# EAGLE design Motor_Surucu_V4 (EAGLE 9.6.2)
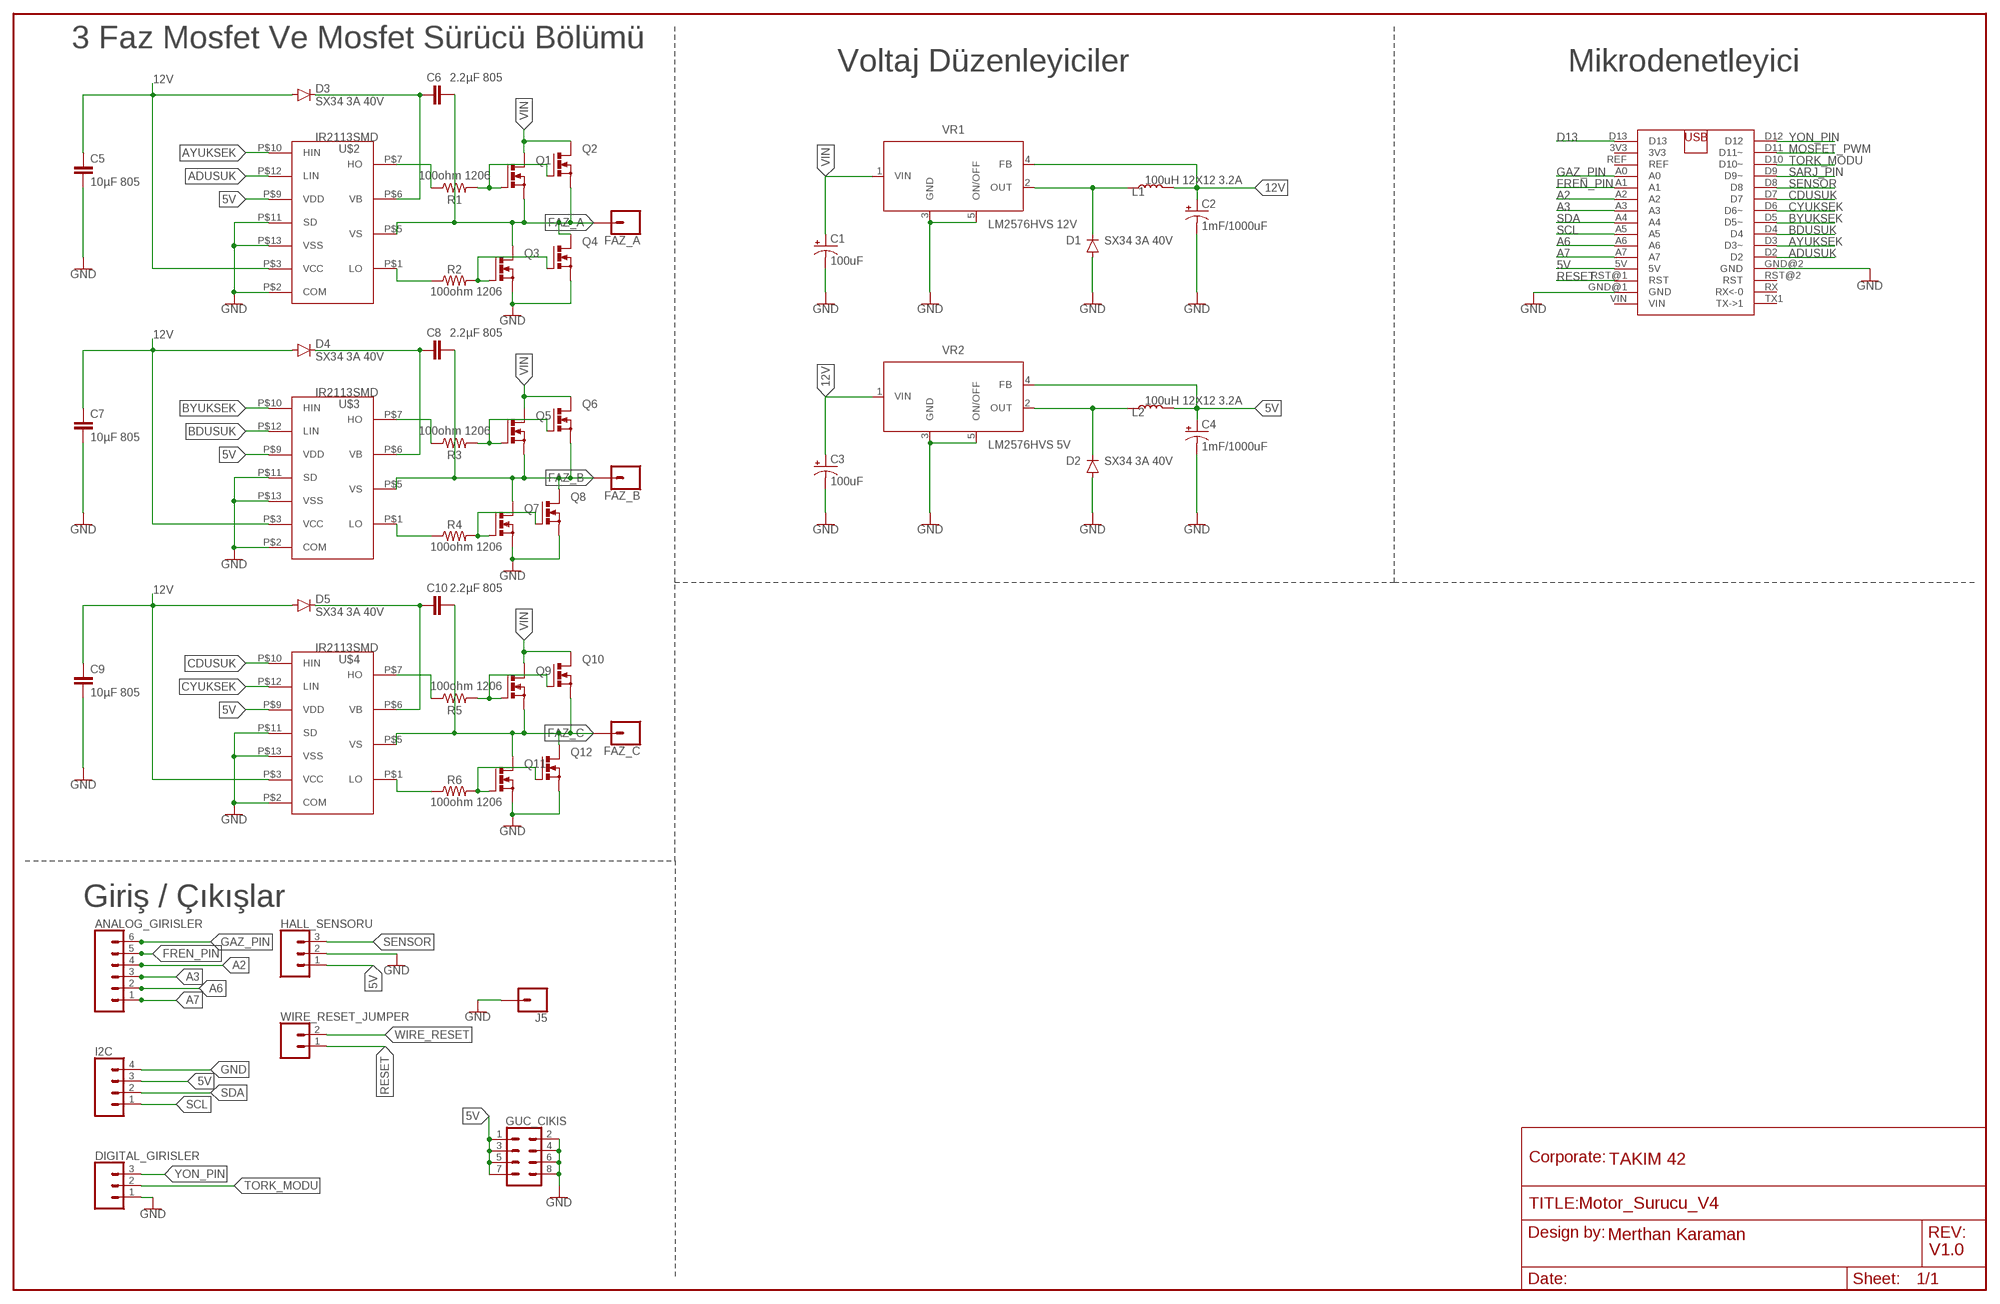
[diagram p0: schematic, sheet 1]
FRAME1 (FRAME-LEDGER): CORPO: TAKIM 42; DESIGNER: Merthan Karaman; REV: V1.0

## Parts
ANALOG_GIRISLER  CONN_06SILK_FEMALE_PTH  [1X06]
C1  100uF  100UF-POLAR-RADIAL-2.5MM-25V-20%  [CPOL-RADIAL-2.5MM-6.5MM]
C2  1mF/1000uF  560UF-PANASONIC_G-25V-20%  [PANASONIC_G]
C3  100uF  100UF-POLAR-RADIAL-2.5MM-25V-20%  [CPOL-RADIAL-2.5MM-6.5MM]
C4  1mF/1000uF  560UF-PANASONIC_G-25V-20%  [PANASONIC_G]
C5  10µF 805  0.33UF/330NF-0805-50V-10%  [0805]
C6  2.2µF 805  0.33UF/330NF-0805-50V-10%  [0805]
C7  10µF 805  0.33UF/330NF-0805-50V-10%  [0805]
C8  2.2µF 805  0.33UF/330NF-0805-50V-10%  [0805]
C9  10µF 805  0.33UF/330NF-0805-50V-10%  [0805]
C10  2.2µF 805  0.33UF/330NF-0805-50V-10%  [0805]
D1  SX34 3A 40V  DIODE-DO214AC  [DO214AC]
D2  SX34 3A 40V  DIODE-DO214AC  [DO214AC]
D3  SX34 3A 40V  DIODE-DO214AC  [DO214AC]
D4  SX34 3A 40V  DIODE-DO214AC  [DO214AC]
D5  SX34 3A 40V  DIODE-DO214AC  [DO214AC]
DIGITAL_GIRISLER  CONN_03  [1X03]
FAZ_A  CONN_01SNAP-MALE  [SNAP-MALE]
FAZ_B  CONN_01SNAP-MALE  [SNAP-MALE]
FAZ_C  CONN_01SNAP-MALE  [SNAP-MALE]
GUC_CIKIS  CONN_04X2  [2X4]
HALL_SENSORU  CONN_03  [1X03]
I2C  CONN_04  [1X04]
J5  CONN_01SNAP-MALE  [SNAP-MALE]
L1  100uH 12X12 3.2A  INDUCTOR-SDR13-27UH  [INDUCTOR_SDR1307]
L2  100uH 12X12 3.2A  INDUCTOR-SDR13-27UH  [INDUCTOR_SDR1307]
Q1  PMOSFET_NTO220BV  [TO220BV]
Q2  PMOSFET_NTO220BV  [TO220BV]
Q3  PMOSFET_NTO220BV  [TO220BV]
Q4  PMOSFET_NTO220BV  [TO220BV]
Q5  PMOSFET_NTO220BV  [TO220BV]
Q6  PMOSFET_NTO220BV  [TO220BV]
Q7  PMOSFET_NTO220BV  [TO220BV]
Q8  PMOSFET_NTO220BV  [TO220BV]
Q9  PMOSFET_NTO220BV  [TO220BV]
Q10  PMOSFET_NTO220BV  [TO220BV]
Q11  PMOSFET_NTO220BV  [TO220BV]
Q12  PMOSFET_NTO220BV  [TO220BV]
R1  100ohm 1206  RESISTOR1206  [1206]
R2  100ohm 1206  RESISTOR1206  [1206]
R3  100ohm 1206  RESISTOR1206  [1206]
R4  100ohm 1206  RESISTOR1206  [1206]
R5  100ohm 1206  RESISTOR1206  [1206]
R6  100ohm 1206  RESISTOR1206  [1206]
U$1  ARDUINO_NANO  [ARDUINO_NANO]
U$2  IR2113SMD  [SOIC-14]
U$3  IR2113SMD  [SOIC-14]
U$4  IR2113SMD  [SOIC-14]
VR1  LM2576HVS 12V  LM2576HVS-5.0/NOPBTO-263  [TO170P1435X465-6N]
VR2  LM2576HVS 5V  LM2576HVS-5.0/NOPBTO-263  [TO170P1435X465-6N]
WIRE_RESET_JUMPER  CONN_02  [1X02]

## Nets
5V: C4.+ GUC_CIKIS.1 GUC_CIKIS.3 GUC_CIKIS.5 GUC_CIKIS.7 HALL_SENSORU.1 I2C.3 L2.P$2 U$1.5V U$2.P$9(VDD) U$3.P$9(VDD) U$4.P$9(VDD) VR2.4(FB)
12V: C2.+ C3.1(+) C5.1 C7.1 C9.1 D3.A D4.A D5.A L1.P$2 U$2.P$3(VCC) U$3.P$3(VCC) U$4.P$3(VCC) VR1.4(FB) VR2.1(VIN)
A2: ANALOG_GIRISLER.4 U$1.A2
A3: ANALOG_GIRISLER.3 U$1.A3
A6: ANALOG_GIRISLER.2 U$1.A6
A7: ANALOG_GIRISLER.1 U$1.A7
ADUSUK: U$1.D2 U$2.P$12(LIN)
AYUKSEK: U$1.D3(D3~) U$2.P$10(HIN)
BDUSUK: U$1.D4 U$3.P$12(LIN)
BYUKSEK: U$1.D5(D5~) U$3.P$10(HIN)
CDUSUK: U$1.D7 U$4.P$10(HIN)
CYUKSEK: U$1.D6(D6~) U$4.P$12(LIN)
D13: U$1.D13
FAZ_A: C6.2 FAZ_A.2 Q1.S Q2.S Q3.D Q4.D U$2.P$5(VS)
FAZ_B: C8.2 FAZ_B.2 Q5.S Q6.S Q7.D Q8.D U$3.P$5(VS)
FAZ_C: C10.2 FAZ_C.2 Q9.S Q10.S Q11.D Q12.D U$4.P$5(VS)
FREN_PIN: ANALOG_GIRISLER.5 U$1.A1
GAZ_PIN: ANALOG_GIRISLER.6 U$1.A0
GND: C1.2(-) C2.- C3.2(-) C4.- C5.2 C7.2 C9.2 D1.A D2.A DIGITAL_GIRISLER.1 GUC_CIKIS.2 GUC_CIKIS.4 GUC_CIKIS.6 GUC_CIKIS.8 HALL_SENSORU.2 I2C.4 J5.2 Q3.S Q4.S Q7.S Q8.S Q11.S Q12.S U$1.GND@1(GND) U$1.GND@2(GND) U$2.P$2(COM) U$2.P$11(SD) U$2.P$13(VSS) U$3.P$2(COM) U$3.P$11(SD) U$3.P$13(VSS) U$4.P$2(COM) U$4.P$11(SD) U$4.P$13(VSS) VR1.3(GND) VR1.5(ON/OFF) VR2.3(GND) VR2.5(ON/OFF)
MOSFET_PWM: U$1.D11(D11~)
N$1: D2.C L2.P$1 VR2.2(OUT)
N$2: Q1.G Q2.G R1.2
N$3: Q5.G Q6.G R3.2
N$4: C6.1 D3.C U$2.P$6(VB)
N$5: R5.1 U$4.P$7(HO)
N$6: R1.1 U$2.P$7(HO)
N$7: Q3.G Q4.G R2.2
N$8: R2.1 U$2.P$1(LO)
N$9: C8.1 D4.C U$3.P$6(VB)
N$10: R3.1 U$3.P$7(HO)
N$11: Q9.G Q10.G R5.2
N$12: Q7.G Q8.G R4.2
N$13: R4.1 U$3.P$1(LO)
N$14: C10.1 D5.C U$4.P$6(VB)
N$17: Q11.G Q12.G R6.2
N$18: R6.1 U$4.P$1(LO)
N$19: D1.C L1.P$1 VR1.2(OUT)
RESET: U$1.RST@1(RST) WIRE_RESET_JUMPER.1
SARJ_PIN: U$1.D9(D9~)
SCL: I2C.1 U$1.A5
SDA: I2C.2 U$1.A4
SENSOR: HALL_SENSORU.3 U$1.D8
TORK_MODU: DIGITAL_GIRISLER.2 U$1.D10(D10~)
VIN: C1.1(+) Q1.D Q2.D Q5.D Q6.D Q9.D Q10.D VR1.1(VIN)
WIRE_RESET: WIRE_RESET_JUMPER.2
YON_PIN: DIGITAL_GIRISLER.3 U$1.D12
Unconnected: U$1.3V3 U$1.REF U$1.RST@2(RST) U$1.RX(RX<-0) U$1.TX1(TX->1) U$1.VIN

## Notes on the sheet
- 3 Faz Mosfet Ve Mosfet Sürücü Bölümü
- Voltaj Düzenleyiciler | Mikrodenetleyici
- Giriş / Çıkışlar

## Library data of the parts
ANALOG_GIRISLER = SparkFun-Connectors:CONN_06: Multi connection point. Often used as Generic Header-pin footprint for 0.1 inch spaced/style header connections On any of the 0.1 inch spaced packages, you can populate with these: Break Away Headers - Straight <https://www.sparkfun.com/products/116> (PRT-00116) Break Away Male Headers - Right Angle <https://www.sparkfun.com/products/553> (PRT-00553) Female Headers <https://www.sparkfun.com/products/115> (PRT-00115) Break Away Headers - Machine Pin <https://www.sparkfun.com/products/117> (PRT-00117) Break Away Female Headers - Swiss Machine Pin <https://www.sparkfun.com/products/743> (PRT-00743) Arduino Stackable Header - 6 Pin <https://www.sparkfun.com/products/9280> (PRT-09280) For SCREWTERMINALS and SPRING TERMINALS visit here: Screw Terimnals on SparkFun.com <https://www.sparkfun.com/search/results?term=Screw+Terminals> (5mm/3.5mm/2.54mm spacing) This device is also useful as a general connection point to wire up your design to another part of your project. Our various solder wires solder well into these plated through hole pads. Hook-Up Wire - Assortment (Stranded, 22 AWG) <https://www.sparkfun.com/products/11375> (PRT-11375) Hook-Up Wire - Assortment (Solid Core, 22 AWG) <https://www.sparkfun.com/products/11367> (PRT-11367) View the entire wire category on our website here <https://www.sparkfun.com/categories/141>; PROD_ID: CONN-08437
C1 C3 = SparkFun-Capacitors:100UF-POLAR: 100µF polarized capacitors A capacitor is a passive two-terminal electrical component used to store electrical energy temporarily in an electric field.; PROD_ID: CAP-08439
C2 C4 = SparkFun-Capacitors:560UF: 560µF polarized capacitors A capacitor is a passive two-terminal electrical component used to store electrical energy temporarily in an electric field.; PROD_ID: CAP-09983; VALUE: 560uF
C5-C10 = SparkFun-Capacitors:0.33UF/330NF: 0.33µF/330nF ceramic capacitors A capacitor is a passive two-terminal electrical component used to store electrical energy temporarily in an electric field.; PROD_ID: CAP-08469; VALUE: 0.33µF
D1-D5 = diode:DIODE-: DIODE
DIGITAL_GIRISLER HALL_SENSORU = SparkFun-Connectors:CONN_03: Multi connection point. Often used as Generic Header-pin footprint for 0.1 inch spaced/style header connections On any of the 0.1 inch spaced packages, you can populate with these: Break Away Headers - Straight <https://www.sparkfun.com/products/116> (PRT-00116) Break Away Male Headers - Right Angle <https://www.sparkfun.com/products/553> (PRT-00553) Female Headers <https://www.sparkfun.com/products/115> (PRT-00115) Break Away Headers - Machine Pin <https://www.sparkfun.com/products/117> (PRT-00117) Break Away Female Headers - Swiss Machine Pin <https://www.sparkfun.com/products/743> (PRT-00743) Stackable Header - 3 Pin (Female, 0.1") <https://www.sparkfun.com/products/13875> (PRT-13875) For SCREWTERMINALS and SPRING TERMINALS visit here: Screw Terimnals on SparkFun.com <https://www.sparkfun.com/search/results?term=Screw+Terminals> (5mm/3.5mm/2.54mm spacing) This device is also useful as a general connection point to wire up your design to another part of your project. Our various solder wires solder well into these plated through hole pads. Hook-Up Wire - Assortment (Stranded, 22 AWG) <https://www.sparkfun.com/products/11375> (PRT-11375) Hook-Up Wire - Assortment (Solid Core, 22 AWG) <https://www.sparkfun.com/products/11367> (PRT-11367) View the entire wire category on our website here <https://www.sparkfun.com/categories/141> Special notes: Molex polarized connector foot print use with SKU : PRT-08232 with associated crimp pins and housings.
FAZ_A FAZ_B FAZ_C J5 = SparkFun-Connectors:CONN_01: Single connection point. Often used as Generic Header-pin footprint for 0.1 inch spaced/style header connections On any of the 0.1 inch spaced packages, you can populate with these: Break Away Headers - Straight <https://www.sparkfun.com/products/116> (PRT-00116) Break Away Male Headers - Right Angle <https://www.sparkfun.com/products/553> (PRT-00553) Female Headers <https://www.sparkfun.com/products/115> (PRT-00115) Break Away Headers - Machine Pin <https://www.sparkfun.com/products/117> (PRT-00117) Break Away Female Headers - Swiss Machine Pin <https://www.sparkfun.com/products/743> (PRT-00743) This device is also useful as a general connection point to wire up your design to another part of your project. Our various solder wires solder well into these plated through hole pads. Hook-Up Wire - Assortment (Stranded, 22 AWG) <https://www.sparkfun.com/products/11375> (PRT-11375) Hook-Up Wire - Assortment (Solid Core, 22 AWG) <https://www.sparkfun.com/products/11367> (PRT-11367) View the entire wire category on our website here <https://www.sparkfun.com/categories/141> Special notes: SMTSO-256-ET is a "flush mount" nut for a 4-40 screw. We mostly use this on specialty testbeds; it is a nice way to connect hardware to your PCB at an adjustable hieght. Also note, the SNAP packages are for using a snappable style connector. We sell a baggie of snaps and they are also used on two LilyPad designs: Snap Assortment - 30 pack (male and female) <https://www.sparkfun.com/products/11347> (DEV-11347) LilyPad Arduino SimpleSnap <https://www.sparkfun.com/products/10941> (DEV-10941) LilyPad SimpleSnap Protoboard <https://www.sparkfun.com/products/10940> (DEV-10940)
GUC_CIKIS = SparkFun-Connectors:CONN_04X2: Multi connection point. Often used as Generic Header-pin footprint for 0.1 inch spaced/style header connections On any of the 0.1 inch spaced packages, you can populate with these: Break Away Headers - Straight <https://www.sparkfun.com/products/116> (PRT-00116) Break Away Male Headers - Right Angle <https://www.sparkfun.com/products/553> (PRT-00553) Female Headers <https://www.sparkfun.com/products/115> (PRT-00115) Break Away Headers - Machine Pin <https://www.sparkfun.com/products/117> (PRT-00117) Break Away Female Headers - Swiss Machine Pin <https://www.sparkfun.com/products/743> (PRT-00743)
I2C = SparkFun-Connectors:CONN_04: Multi connection point. Often used as Generic Header-pin footprint for 0.1 inch spaced/style header connections On any of the 0.1 inch spaced packages, you can populate with these: Break Away Headers - Straight <https://www.sparkfun.com/products/116> (PRT-00116) Break Away Male Headers - Right Angle <https://www.sparkfun.com/products/553> (PRT-00553) Female Headers <https://www.sparkfun.com/products/115> (PRT-00115) Break Away Headers - Machine Pin <https://www.sparkfun.com/products/117> (PRT-00117) Break Away Female Headers - Swiss Machine Pin <https://www.sparkfun.com/products/743> (PRT-00743) For SCREWTERMINALS and SPRING TERMINALS visit here: Screw Terimnals on SparkFun.com <https://www.sparkfun.com/search/results?term=Screw+Terminals> (5mm/3.5mm/2.54mm spacing) This device is also useful as a general connection point to wire up your design to another part of your project. Our various solder wires solder well into these plated through hole pads. Hook-Up Wire - Assortment (Stranded, 22 AWG) <https://www.sparkfun.com/products/11375> (PRT-11375) Hook-Up Wire - Assortment (Solid Core, 22 AWG) <https://www.sparkfun.com/products/11367> (PRT-11367) View the entire wire category on our website here <https://www.sparkfun.com/categories/141> Special notes: Molex polarized connector foot print use with SKU : PRT-08231 with associated crimp pins and housings. 1MM SMD Version SKU: PRT-10208; PROD_ID: CONN-09696
L1 L2 = SparkFun-Coils:INDUCTOR: Inductors Resist changes in electrical current. Basically a coil of wire. SparkFun Products: SparkFun Load Cell Amplifier - HX711 <https://www.sparkfun.com/products/13879> IOIO-OTG - V2.2 <https://www.sparkfun.com/products/13613>; PROD_ID: NDUC-12529; VALUE: 27µH/±20%/3.3A
Q1-Q12 = transistor-power:PMOSFET_N: Power MOSFET N-Channel
R1-R6 = SparkFun-Resistors:RESISTOR: Generic Resistor Package
U$1 = El_yapimi:ARDUINO_NANO
U$2-U$4 = El_yapimi:IR2113SMD
VR1 VR2 = IC_Power-Management:LM2576HVS-5.0/NOPB: SIMPLE SWITCHER® 3-A Step-Down Voltage Regulator Datasheet <http://www.ti.com/lit/ds/symlink/lm2576hv.pdf>; CATEGORY: IC_Power-Management; MANUFACTURER: TI; MPN: LM2576HVS-5.0/NOPB; OPERATING_TEMP: -40 to +125 °C; PART_STATUS: Active; ROHS_COMPLIANT: Non Compliant; SERIES: LM2576xx; SUB-CATEGORY: Voltage Regulator; TYPE: DC-DC Switching; VALUE: LM2576HVS
WIRE_RESET_JUMPER = SparkFun-Connectors:CONN_02: Multi connection point. Often used as Generic Header-pin footprint for 0.1 inch spaced/style header connections On any of the 0.1 inch spaced packages, you can populate with these: Break Away Headers - Straight <https://www.sparkfun.com/products/116> (PRT-00116) Break Away Male Headers - Right Angle <https://www.sparkfun.com/products/553> (PRT-00553) Female Headers <https://www.sparkfun.com/products/115> (PRT-00115) Break Away Headers - Machine Pin <https://www.sparkfun.com/products/117> (PRT-00117) Break Away Female Headers - Swiss Machine Pin <https://www.sparkfun.com/products/743> (PRT-00743) For SCREWTERMINALS and SPRING TERMINALS visit here: Screw Terimnals on SparkFun.com <https://www.sparkfun.com/search/results?term=Screw+Terminals> (5mm/3.5mm/2.54mm spacing) This device is also useful as a general connection point to wire up your design to another part of your project. Our various solder wires solder well into these plated through hole pads. Hook-Up Wire - Assortment (Stranded, 22 AWG) <https://www.sparkfun.com/products/11375> (PRT-11375) Hook-Up Wire - Assortment (Solid Core, 22 AWG) <https://www.sparkfun.com/products/11367> (PRT-11367) View the entire wire category on our website here <https://www.sparkfun.com/categories/141> Special notes: Molex polarized connector foot print use with: PRT-08233 with associated crimp pins and housings. 2.54_SCREWTERM for use with PRT-10571. 3.5mm Screw Terminal footprints for PRT-08084 5mm Screw Terminal footprints for use with PRT-08432

## Board
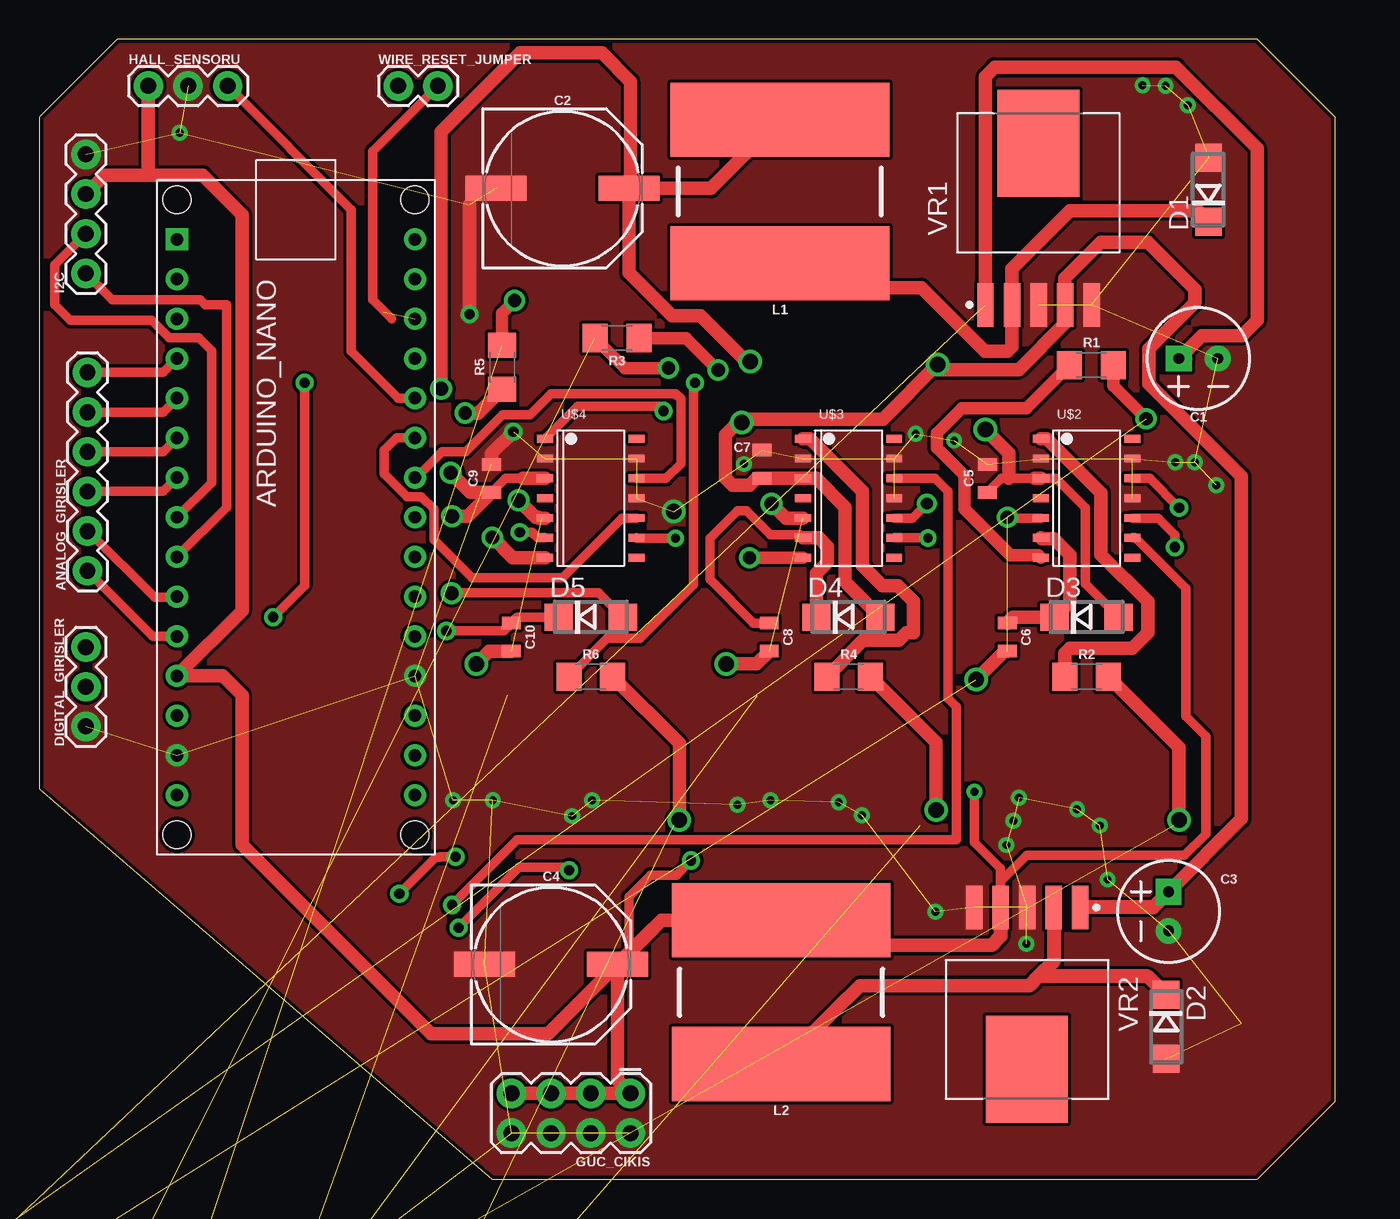
[diagram p1: board, top side]
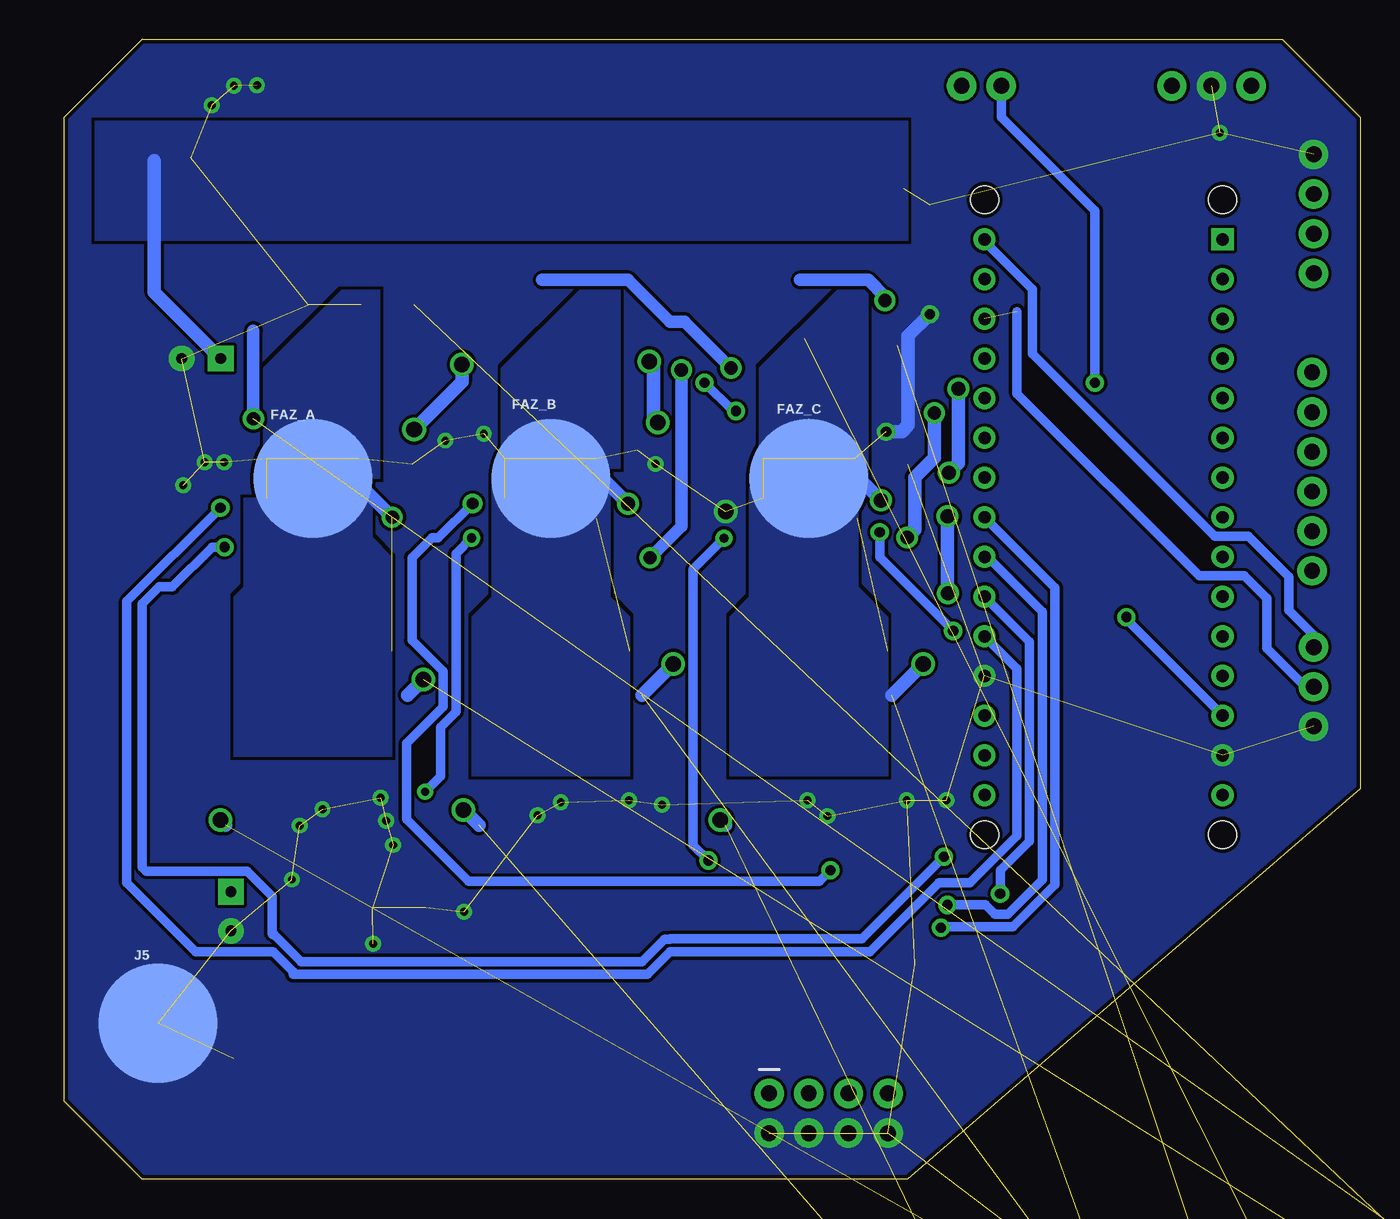
[diagram p2: board, bottom side, seen from below]

Size 83 x 73 mm. Coordinates in mm from the lower left corner, seen from the top.
Outline: 78,73 5,73 0,68 0,25 29,0 78,0 83,5 83,68 78,73
Copper layers (1*16): Top 0.035mm / dielectric 1.5mm / Bottom 0.035mm
Design rules "SparkFun": minimum track width 8mil, minimum drill 20mil, track to track 8mil, track to pad 8mil, pad to pad 8mil, via to via 8mil, smd to smd 8mil, copper to edge 10mil, drill to drill 8mil, minimum pad ring 12mil, minimum via ring 10mil, stop-mask expansion 4mil, vias tented up to drill 25mil, thermal gap 10mil

### Footprints (pad centres in the part's own frame; a part is rotated, then mirrored left to right if it is on the bottom)
1X06 = drill 1.016 pad 1.88: 1 0,0; 2 2.54,0; 3 5.08,0; 4 7.62,0; 5 10.16,0; 6 12.7,0
CPOL-RADIAL-2.5MM-6.5MM = drill 0.7 pad 1.651 square: 1 1.25,0 | drill 0.7 pad 1.651: 2 -1.25,0
PANASONIC_G = smd 3.9 x 1.6: + 4.25,0; - -4.25,0
0805 = smd 0.8 x 1.2: 1 -0.9,0; 2 0.9,0
DO214AC = smd 1.8 x 1.7: A 2.05,0; C -2.05,0
1X03 = drill 1.016 pad 1.88: 1 0,0; 2 2.54,0; 3 5.08,0
SNAP-MALE = smd 7.62 x 7.62: 2 0,0
2X4 = drill 1.016 pad 1.88: 1 -3.81,-1.27; 2 -3.81,1.27; 3 -1.27,-1.27; 4 -1.27,1.27; 5 1.27,-1.27; 6 1.27,1.27; 7 3.81,-1.27; 8 3.81,1.27
1X04 = drill 1.016 pad 1.88: 1 0,0; 2 2.54,0; 3 5.08,0; 4 7.62,0
INDUCTOR_SDR1307 = smd 14 x 4.75: P$1 0,4.6; P$2 0,-4.6
TO220BV = drill 1.016 long: D 0,-2.54; G -2.54,-2.54; S 2.54,-2.54
1206 = smd 1.6 x 1.8: 1 -1.4,0; 2 1.4,0
ARDUINO_NANO = drill 0.8: 3V3 -7.62,13.97; 5V -7.62,-11.43; A0 -7.62,8.89; A1 -7.62,6.35; A2 -7.62,3.81; A3 -7.62,1.27; A4 -7.62,-1.27; A5 -7.62,-3.81; A6 -7.62,-6.35; A7 -7.62,-8.89; D2 7.62,-8.89; D3 7.62,-6.35; D4 7.62,-3.81; D5 7.62,-1.27; D6 7.62,1.27; D7 7.62,3.81; D8 7.62,6.35; D9 7.62,8.89; D10 7.62,11.43; D11 7.62,13.97; D12 7.62,16.51; GND@1 -7.62,-16.51; GND@2 7.62,-11.43; REF -7.62,11.43; RST@1 -7.62,-13.97; RST@2 7.62,-13.97; RX 7.62,-16.51; TX1 7.62,-19.05; VIN -7.62,-19.05 | drill 0.8 square: D13 -7.62,16.51 | hole 1.778: -7.62,19.05; 7.62,19.05; 7.62,-21.59; -7.62,-21.59
SOIC-14 = smd 1.016 x 0.508: P$1 -2.921,3.81; P$2 -2.921,2.54; P$3 -2.921,1.27; P$4 -2.921,0; P$5 -2.921,-1.27; P$6 -2.921,-2.54; P$7 -2.921,-3.81; P$8 2.921,-3.81; P$9 2.921,-2.54; P$10 2.921,-1.27; P$11 2.921,0; P$12 2.921,1.27; P$13 2.921,2.54; P$14 2.921,3.81
TO170P1435X465-6N = smd 2.792 x 1.053: 1 -6.185,3.4; 2 -6.185,1.7; 3 -6.185,0; 4 -6.185,-1.7; 5 -6.185,-3.4 | smd 6.842 x 5.252: 6 4.16,0
1X02 = drill 1.016 pad 1.88: 1 0,0; 2 2.54,0

### Placement (x,y rotation side)
ANALOG_GIRISLER  3.1,38.96 90 top
C1  74.24,52.55 180 top
C2  33.52,63.44 0 top
C3  72.33,17.16 90 top
C4  32.79,13.77 0 top
C5  60.73,44.88 90 top
C6  62,34.72 270 top
C7  46.29,45.78 90 top
C8  46.76,34.72 270 top
C9  28.98,44.88 90 top
C10  30.25,34.72 270 top
D1  74.89,63.36 90 top
D2  72.16,9.78 270 top
D3  67.08,35.99 0 top
D4  51.84,35.99 0 top
D5  35.33,35.99 0 top
DIGITAL_GIRISLER  3,29 90 top
FAZ_A  67.08,44.88 0 bottom
FAZ_B  51.84,44.88 0 bottom
FAZ_C  35.33,44.88 0 bottom
GUC_CIKIS  34.06,4.24 180 top
HALL_SENSORU  7,70 0 top
I2C  3,58 90 top
J5  77,10 0 bottom
L1  47.44,63.24 180 top
L2  47.52,11.99 180 top
Q1  -9.12,-7.19 0 top  (outside the outline)
Q2  -9.12,-14.81 0 top  (outside the outline)
Q3  -9.12,-22.43 0 top  (outside the outline)
Q4  -9.12,-30.05 0 top  (outside the outline)
Q5  -9.12,-37.67 0 top  (outside the outline)
Q6  -9.12,-45.29 0 top  (outside the outline)
Q7  -9.12,-52.91 0 top  (outside the outline)
Q8  -9.12,-60.53 0 top  (outside the outline)
Q9  -9.12,-68.15 0 top  (outside the outline)
Q10  -9.12,-75.77 0 top  (outside the outline)
Q11  -9.12,-83.39 0 top  (outside the outline)
Q12  -9.12,-91.01 0 top  (outside the outline)
R1  67.38,52.13 0 top
R2  67.08,32.18 0 top
R3  37.01,53.86 180 top
R4  51.84,32.18 0 top
R5  29.66,51.99 90 top
R6  35.33,32.18 0 top
U$1  16.45,43.66 0 top
U$2  67.08,43.61 0 top
U$3  51.84,43.61 0 top
U$4  35.33,43.61 0 top
VR1  64,62.17 90 top
VR2  63.27,11.23 270 top
WIRE_RESET_JUMPER  23,70 0 top

### Tracks (layer width: path | path; a pad name or v marks a point on that pad's centre or on a via)
5V  (via drill 0.51, 0.6, 0.65)
  Top 0.61: v40.75,41.05 38.28,41.05 U$4.P$9 | v41.76,20.42 40.82,19.48 39.14,19.48 37.77,18.11 37.77,14.5 | U$3.P$9 v56.92,41.07 | v59.9,24.81 59.9,21.58 61.57,19.91 61.57,19.05 | 61.57,19.05 63.27,20.75 73.34,20.75 74.7,22.11 74.7,28.37 73.43,29.64 73.43,37.85 70.21,41.07 U$2.P$9 | 61.57,19.05 VR2.4
  Top 0.864: 7,64.28 4.2,64.28 I2C.3 | 7,64.28 10.48,64.28 13,61.77 13,36.4 U$1.5V 11.77,32.23 13,31 13,21.44 25.12,9.32 32.58,9.32 C4.+ 37.04,6.34 GUC_CIKIS.1 GUC_CIKIS.3 GUC_CIKIS.5 GUC_CIKIS.7 | HALL_SENSORU.1 7,64.28 | 61,15 49.11,15 L2.P$2 39.85,16.59 39.26,16
  Top 0.889: VR2.4 61.57,15.57 61,15 | C4.+ 37.77,14.5 39.26,16
  Bottom 0.61: v41.76,20.42 42.74,21.4 42.74,39.06 v40.75,41.05 | v56.92,41.07 57.92,40.07 57.92,29.93 58.91,28.94 58.91,25.8 v59.9,24.81
12V  (via drill 0.9, 1)
  Top 0.61: C9.1 29.88,44.88 31,44.88 | C5.1 61.63,44.88 62.1,44.88 U$2.P$3 65.12,44.88 67,43 67,38.12 D3.A | D4.A 53.89,36.11 | v26.42,37.53 26.44,37.55 35.82,37.55 D5.A
  Top 0.864: L1.P$2 43.04,63.44 C2.+ | v26.36,45.23 27.61,43.98 C9.1 27.44,42.44 v26.43,42.44 | 31,44.88 U$4.P$3 | C2.+ 37.77,58.04 40.53,55.27 42.36,55.27 45.27,52.37 v45.54,52.37 | 63.77,44.88 U$2.P$3 | C3.1 77,23.08 77,45 71.07,50.93 71.07,53.18 74,56.11 74,57 71,60 68,60 65.7,57.7 VR1.4 65.7,54.8 62.74,51.84 57.54,51.84 v57.54,52.17 54.03,48.66 45.2,48.66 v45,48.46 44.75,48.46 43.96,47.67 43.96,44.87 44.4,44.43 45.51,44.43 45.96,44.88 C7.1 U$3.P$3 49.77,44.88 51.62,43.03 51.62,38.26 D4.A | 62.1,44.88 62.1,46.5 v60.6,48 | v25.75,50.62 25.75,67.06 30.81,72.11 36.04,72.11 37.87,70.28 37.87,63.54 C2.+
  Top 0.889: C3.1 71.34,17.43 VR2.1
  Bottom 0.864: v25.75,50.62 25.75,45.84 v26.36,45.23 | v26.43,42.44 26.43,37.54 v26.42,37.53 | v45.54,52.37 45.27,52.09 45.27,48.73 v45,48.46 | v57.54,52.17 57.54,51.06 v60.6,48
A2
  Top 0.61: U$1.A2 7.94,46.58 ANALOG_GIRISLER.4
A3
  Top 0.61: U$1.A3 7.94,44.04 ANALOG_GIRISLER.3
A6
  Top 0.61: ANALOG_GIRISLER.2 3.15,41.5 7.39,37.26 8.78,37.26 U$1.A6
A7
  Top 0.61: U$1.A7 7.29,34.77 ANALOG_GIRISLER.1
ADUSUK  (via drill 0.65)
  Top 0.61: v73,43 71.12,44.88 U$2.P$12
  Bottom 0.61: v73,43 79,37 79,19 74.58,14.58 69.62,14.58 68.35,13.31 68.35,13.13 45.67,13.13 44.22,14.58 31.42,14.58 27,19 25,19 22,22 22,32.7 U$1.D2
AYUKSEK  (via drill 0.65)
  Top 0.61: v72.74,40.48 72.74,41.26 71.66,42.34 U$2.P$10 | v23.07,18.29 25.4,20.62 25.67,20.62 25.7,20.65 v26.68,20.65
  Bottom 0.61: v26.68,20.65 31.94,15.4 44.22,15.4 44.23,15.39 44.56,15.39 46,13.94 67.84,13.94 69.56,15.67 69.62,15.67 69.69,15.74 69.69,18.14 71.29,19.74 77.74,19.74 78,20 78,36.85 76.93,37.92 76.07,37.92 73.52,40.48 v72.74,40.48 | v23.07,18.29 23.07,19.78 21.19,21.66 21.19,34.43 U$1.D3
BDUSUK  (via drill 0.65)
  Top 0.61: U$3.P$12 57.37,44.88 58.19,44.06 58.19,30.81 58.73,30.27 58.73,21.74 30.61,21.74 v26.44,17.57
  Bottom 0.61: U$1.D4 23.89,39.85 20.37,36.33 20.37,19.19 22.58,16.98 23.42,16.98 24.01,17.57 v26.44,17.57
BYUKSEK  (via drill 0.65, 0.75)
  Top 0.61: v56.86,43.26 55.94,42.34 U$3.P$10 | v26.86,16.12 30.74,20 33.94,20 v33.94,19.8
  Bottom 0.61: U$1.D5 19.56,37.88 19.56,18.85 22.24,16.17 26.81,16.17 v26.86,16.12 | v33.94,19.8 34.65,19.09 57.11,19.09 61.07,23.05 61.07,27.93 58.74,30.26 58.74,32.52 60.73,34.52 60.73,39.8 59.46,41.07 59.05,41.07 v56.86,43.26
CDUSUK
  Top 0.61: U$1.D7 22.89,47.47 22.1,46.68 22.1,45.18 23.57,43.72 24.46,43.72 25.28,42.89 25.28,40.96 27.72,38.52 33.52,38.52 37.34,42.34 U$4.P$10
CYUKSEK
  Top 0.61: U$4.P$12 40.15,44.88 41.1,45.83 41.1,49.96 40.76,50.3 32.79,50.3 31.45,48.96 29.68,48.96 27.31,46.59 25.8,46.59 24.15,44.93 U$1.D6
FAZ_A  (via drill 0.85, 1)  (5 unrouted)
  Top 0.61: U$2.P$5 62.05,42.34 v62,42.39
  Top 0.864: C6.2 61.82,33.82 v60,32
  Bottom 0.864: FAZ_A.2 64.49,44.88 v62,42.39 | 61,31 v60,32
  pour Bottom (no thermals): 62.76,56.92 65.25,56.92 70.25,51.92 70.25,44.88 62.76,44.88
  pour Bottom (no thermals): 72.16,27.1 62,27.1 62,39.8 63.27,41.07 63.27,43.61 71.53,43.61 71.53,37.9 72.16,37.26
FAZ_B  (via drill 0.9, 1)  (5 unrouted)
  Top 0.864: C8.2 45.94,33 v44,33 | v46.91,43.25 47.83,42.34 U$3.P$5
  Bottom 0.864: FAZ_B.2 48.54,44.88 v46.91,43.25 | v44,33 46,31
  Bottom 5.08: FAZ_B.2 52,44.72
  pour Bottom (no thermals): 47.39,56.92 50.02,56.92 55.02,51.92 55.02,45.52 47.39,45.52
  pour Bottom (no thermals): 55.65,44.88 55.65,37.26 56.92,35.99 56.92,25.83 46.76,25.83 46.76,35.99 48.03,37.26 48.03,44.88
FAZ_C  (via drill 0.9, 1)  (5 unrouted)
  Top 0.61: 32.2,42.34 U$4.P$5
  Top 0.864: v30.71,43.46 31.79,42.38 31.97,42.38 32,42.34 U$4.P$5 | C10.2 28.82,33.82 v28,33
  Bottom 0.864: FAZ_C.2 32.12,44.88 v30.71,43.46 | 30,31 v28,33
  pour Bottom (no thermals): 31.52,56.92 33.5,56.92 38.5,51.92 38.5,44.88 31.52,44.88
  pour Bottom (no thermals): 40.41,25.83 30.25,25.83 30.25,35.99 32.16,37.9 32.16,38.53 32.16,44.24 39.14,44.24 39.14,37.9 39.14,37.26 40.41,35.99
FREN_PIN
  Top 0.61: U$1.A1 7.94,49.12 ANALOG_GIRISLER.5
GAZ_PIN
  Top 0.61: U$1.A0 7.94,51.66 ANALOG_GIRISLER.6
GND  (via drill 0.51, 0.65, 1)  (64 unrouted)
  Top 0.864: C9.2 28.98,46.48 v30.37,47.87 | v27.57,55.39 27.57,62.39
  Bottom 0.864: v30.37,47.87 29.37,47.87 28.97,48.28 28.97,53.99 v27.57,55.39
  other vias: 58.6,47.3 40.65,42.75 73.56,68.76 9,67 45.15,45.8 56.13,47.72 61.95,21.41 62.38,22.96 68.43,19.2 72.14,70.01 70.66,70.05 57.4,17.14 63.22,15.09 75.39,44.45 72.77,45.92 74.01,45.92 67.92,22.66 66.47,23.7 62.74,24.43 52.7,23.32 51.2,24.15 46.84,24.28 44.73,23.98 34.14,23.26 35.41,24.28 29.06,24.28 26.52,24.28
  pour Top (rank 3, no thermals): -10.85,78.3 -10.85,-2.7 89.21,-2.7 89.21,78.3
  pour Bottom (rank 3, no thermals): -15.01,83.27 -15,-6 93,-6 93.01,83.27
N$1
  Top 0.864: 63.42,12.42 52.56,12.42 51.72,11.58 L2.P$1
  Top 0.889: VR2.2 64.97,13.97 64,13 | 64,13 63.42,12.42 | D2.C 70.99,13 64,13
N$2  (via drill 0.85)  (2 unrouted)
  Top 0.813: R1.2 68.78,50.8 v70.89,48.69
  Bottom 0.813: v70.89,48.69 70.89,54.33
N$3  (via drill 0.85)  (2 unrouted)
  Top 0.813: R3.2 37.53,51.94 v40.31,51.94
  Bottom 0.813: v40.31,51.94 43.28,54.91 44.22,54.91 46.89,57.58 52.4,57.58
N$4
  Top 0.864: U$2.P$6 64.23,41 65,41 66,40 66,36.96 D3.C 62.37,35.99 C6.1
N$5  (via drill 0.85)
  Top 0.864: U$4.P$7 30.33,39.8 v29.03,41.09 | R5.1 28.13,49.06 v27.28,49.06
  Bottom 0.864: v27.28,49.06 27.28,46.21 28.53,44.95 28.53,41.59 v29.03,41.09
N$6
  Top 0.813: U$2.P$7 64,39.96 62.2,39.96 59.24,42.92 59.24,45.08 57.48,46.84 57.48,47.76 59.08,49.36 63.21,49.36 R1.1
N$7  (via drill 1)  (2 unrouted)
  Top 0.864: R2.2 73,27.66 v73,23
  Bottom 0.864: v73,23 72.67,22.67
N$8
  Top 0.864: R2.1 65.68,33.68 66,34 70,34 71,35 71,37 68,40 68,43.97 64.55,47.42 U$2.P$1
N$9
  Top 0.61: C8.1 45.76,35.62 42.97,38.41 42.97,41.03 44.73,42.8 45.31,42.8 46.84,41.27 48.72,41.27 U$3.P$6
  Top 0.864: D4.C 49.79,38.79 50.5,39.5 50.5,40.5 49.93,41.07 U$3.P$6
N$10  (via drill 0.85)
  Top 0.813: U$3.P$7 v45.49,39.8 | v43.48,51.81 41.44,53.86 R3.1
  Bottom 0.813: v45.49,39.8 43.48,41.81 v43.48,51.81
N$11  (via drill 0.85)  (2 unrouted)
  Top 0.813: v30.45,56.26 29.66,55.46 R5.2
  Bottom 0.813: v30.45,56.26 30.45,56.51 31.52,57.58 35.89,57.58
N$12  (via drill 1)  (2 unrouted)
  Top 0.864: R4.2 57.44,27.98 v57.44,23.66
  Bottom 0.864: v57.44,23.66 56.45,22.67
N$13
  Top 0.864: R4.1 52.77,34.51 55.05,34.51 55.55,35 56,35 56,37 55,38 54,38 52.71,39.29 52.71,44.06 49.35,47.42 U$3.P$1
N$14  (via drill 0.65)
  Top 0.61: D5.C 30.62,35.99 C10.1 29.74,35.11 v26.08,35.11 | U$4.P$6 31.95,41.07 31.58,41.44 v30.79,41.44
  Bottom 0.61: v30.79,41.44 30.79,39.82 v26.08,35.11
N$17  (via drill 1)  (2 unrouted)
  Top 0.864: R6.2 41,27.91 v41,23
  Bottom 0.864: v41,23 40.67,22.67
N$18  (via drill 0.65)
  Top 0.61: R6.1 36.38,34.63 38.49,34.63 41.92,38.06 41.92,50.92 v42,51 | v39.99,49.19 39.7,49.48 34.47,49.48 U$4.P$1
  Bottom 0.61: v42,51 40.19,49.19 v39.99,49.19
N$19
  Top 0.864: D1.C 74.2,62 66,62 62.3,58.3 VR1.2 62.3,53.3 62,53 60.58,53 56.49,57.09 48.99,57.09 L1.P$1
RESET  (via drill 0.65)
  Top 0.61: v17,51 17,38 v15,36
  Bottom 0.61: WIRE_RESET_JUMPER.1 23,68 17,62 v17,51 | v15,36 15,35.86 U$1.RST@1
SCL
  Top 0.61: I2C.1 4.7,56.3 10.33,56.3 10.64,56 12,56 12,43.02 U$1.A5
SDA
  Top 0.61: U$1.A4 11.04,44.6 11.04,53.05 10.22,53.88 8.33,53.88 7.2,55 2,55 1,56 1,58.54 I2C.2
SENSOR
  Top 0.61: HALL_SENSORU.3 20,62.08 20,53 22.99,50.01 U$1.D8
TORK_MODU  (1 unrouted)
  Bottom 0.61: 22,55.56 22,50.3 10.33,38.64 7.44,38.64 6,37.2 6,34 3.54,31.54 DIGITAL_GIRISLER.2
VIN  (6 unrouted)
  Top 0.864: VR1.1 60.6,70.6 61.2,71.2 72.8,71.2 78,66 78,55 77.01,54.01 74.45,54.01 C1.1 73.43,52.55
  Bottom 0.864: 77.24,65.2 77.24,56.8 C1.1
  pour Bottom (no thermals): 81.05,67.74 81.05,60.12 28.98,60.12 28.98,67.74
WIRE_RESET
  Top 0.61: 22.58,55.09 21.36,56.31 21.36,65.82 WIRE_RESET_JUMPER.2
YON_PIN
  Bottom 0.61: DIGITAL_GIRISLER.3 3,34.84 4.58,36.42 4.58,38.58 7.18,41.18 9.33,41.18 21,52.84 21,57 24.07,60.07 U$1.D12